# EAGLE design DeckunitV1 (EAGLE 9.6.2)
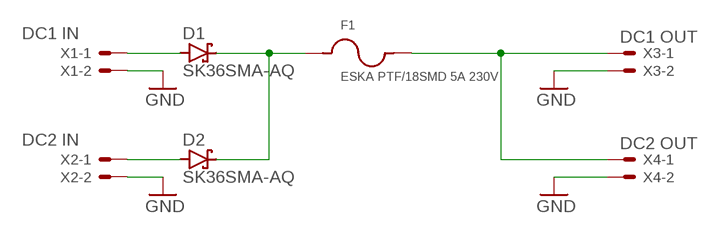
[diagram p0: schematic, sheet 1]

## Parts
D1  SK36SMA-AQ  SS12  [SMA]
D2  SK36SMA-AQ  SS12  [SMA]
F1  ESKA PTF/18SMD 5A 230V  65800001109  [65800001109]
X1  DC1 IN  22-23-20212PIN  [2PIN]
X2  DC2 IN  22-23-20212PIN  [2PIN]
X3  DC1 OUT  22-23-20212PIN  [2PIN]
X4  DC2 OUT  22-23-20212PIN  [2PIN]

## Nets
GND: X1.2 X2.2 X3.2 X4.2
V1+: D1.A X1.1
V2+: D2.A X2.1
V+: D1.C D2.C F1.1
V+F: F1.2 X3.1 X4.1

## Library data of the parts
D1 D2 = Diodes:SS12: DIODE SCHOTTKY 20V 1A SMA Manufacturer's datasheet <https://www.onsemi.com/pub/Collateral/SS19-D.PDF>; CREATED_BY: PCBLayout.com; DIGIKEY_PART_NUMBER: SS12FSCT-ND; MANUFACTURER: ON Semiconductor; MPN: SS12; PACKAGE: SMA (DO-214AC)
F1 = Fuse Holder:65800001109: FUSE BLOK CARTRIDGE 250V 10A SMD Manufacturer's datasheet <https://www.littelfuse.com/~/media/electronics/datasheets/fuse_blocks/littelfuse_fuse_block_658_datasheet.pdf.pdf>; CREATED_BY: PCBLayout.com; DIGIKEY_PARTNO: WK6249TR-ND; MANUFACTURER: Littelfuse Inc.; MPN: 65800001109
X1-X4 = con-molex:22-23-2021: .100" (2.54mm) Center Header - 2 Pin

## Board
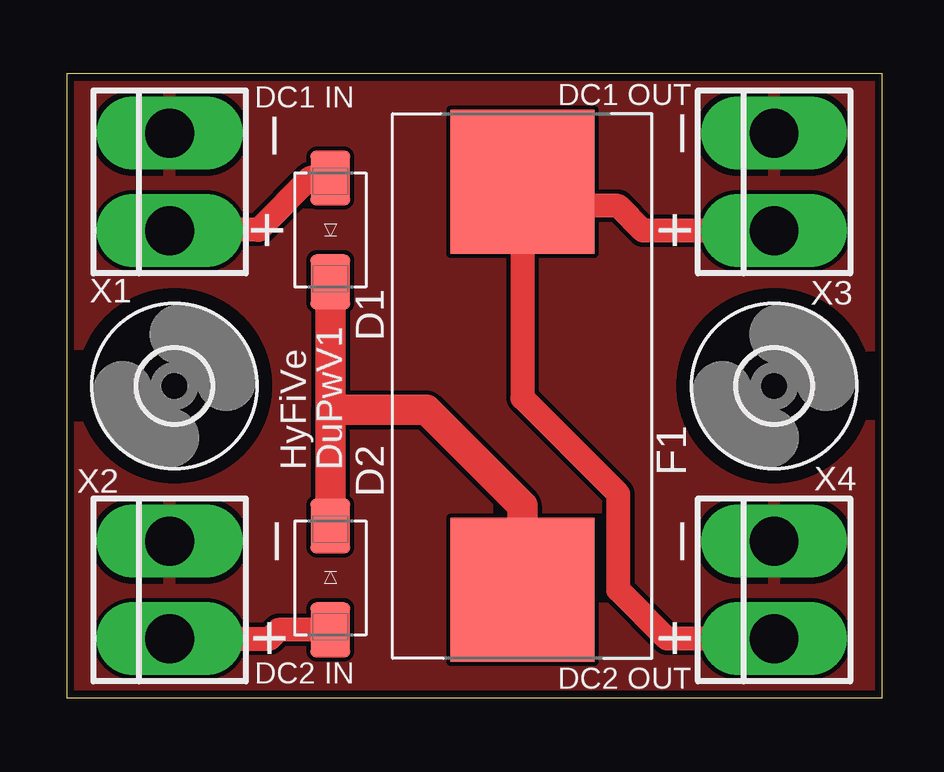
[diagram p1: board, top side]
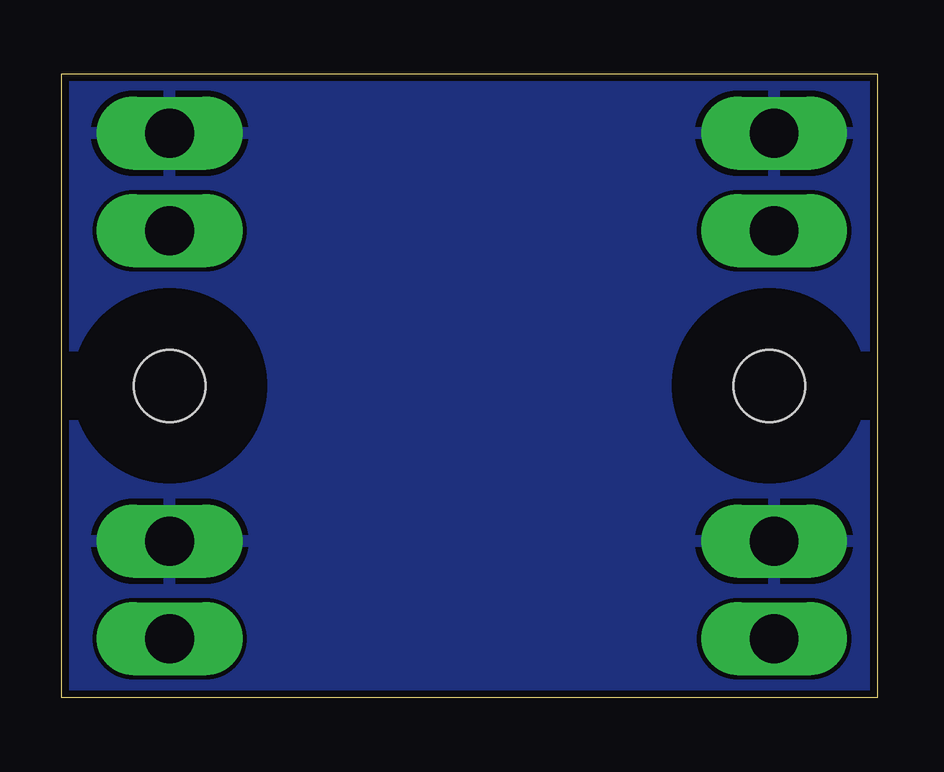
[diagram p2: board, bottom side, seen from below]

Size 34 x 26 mm. Coordinates in mm from the lower left corner, seen from the top.
Outline: 0,0 34,0 34,26 0,26 0,0
Copper layers (1*16): Top 0.035mm / dielectric 1.5mm / Bottom 0.035mm
Design rules "aisler_simple": minimum track width 0.2mm, minimum drill 0.45mm, track to track 0.175mm, track to pad 0.175mm, pad to pad 0.175mm, via to via 0.175mm, smd to smd 0.175mm, copper to edge 0.3mm, drill to drill 0.25mm, minimum pad ring 0.2mm, minimum via ring 0.2mm, stop-mask expansion 0mil, vias tented up to drill 0mil, thermal gap 10mil

### Footprints (pad centres in the part's own frame; a part is rotated, then mirrored left to right if it is on the bottom)
SMA = smd 2.28 x 1.66: A 2.165,0; C -2.165,0
65800001109 = smd 6 x 6: 1 -8.5,0; 2 8.5,0
3,0 = hole 3: 0,0
2PIN = drill 2.032 long: 1 -2.032,0; 2 2.032,0

### Placement (x,y rotation side)
D1  11,19.5 90 top
D2  11,5 270 top
F1  19,13 90 top
U$1  [3,0]  4.5,13 0 top
U$2  [3,0]  29.5,13 0 top
X1  4.3,21.5 90 top
X2  4.3,4.5 90 top
X3  29.5,21.5 90 top
X4  29.5,4.5 90 top

### Tracks (layer width: path | path; a pad name or v marks a point on that pad's centre or on a via)
GND
  pour Bottom: 0,26 0,0 34,0 34,26
  pour Top: 0,26 0,0 34,0 34,26
V1+
  Top 1: X1.1 4.33,19.5 8,19.5 10.16,21.66 D1.A
V2+
  Top 1: X2.1 8.47,2.47 8.84,2.83 D2.A
V+
  Top 1.27: D2.C 11,12 | 11,12 15,12 19,8 F1.1 | D1.C 11,12
V+F
  Top 1: 19,20.5 F1.2 | X3.1 24.03,19.47 23,20.5 19,20.5 | X4.1 25.03,2.47 23,4.5 23,8.5 19,12.5 19,20.5

### Text on the board
tNames: _ | _ | + | + | HyFiVe | DuPwV1 | _ | _ | + | +